# Altium schematic sheet Interface2.SchDoc
size A4; SheetNumber: 9; SheetTotal: 9
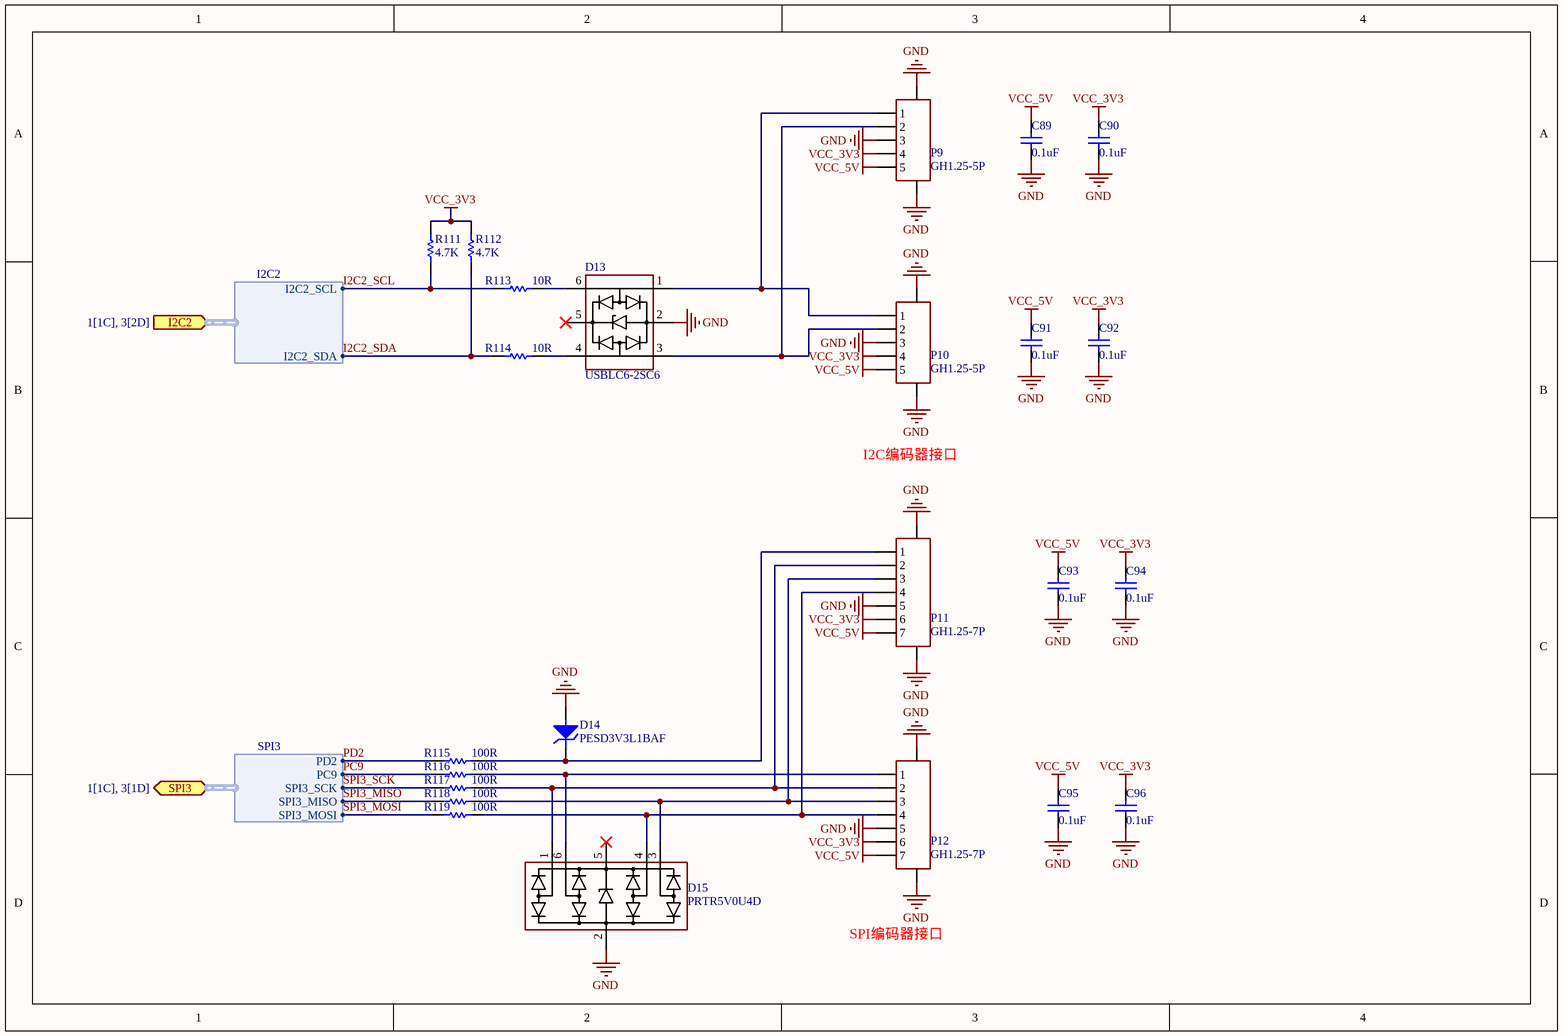
[diagram p0: Interface2.SchDoc]

## Parts
C89  0.1uF  [C0603_NS]
C90  0.1uF  [C0603_NS]
C91  0.1uF  [C0603_NS]
C92  0.1uF  [C0603_NS]
C93  0.1uF  [C0603_NS]
C94  0.1uF  [C0603_NS]
C95  0.1uF  [C0603_NS]
C96  0.1uF  [C0603_NS]
D13  USBLC6-2SC6  [SOT23-6N]
D14  PESD3V3L1BAF  [SOD-323]
D15  PRTR5V0U4D  [SOT-457(SC-74)]
P9  GH1.25-5P  [A1257WR-S-5P]
P10  GH1.25-5P  [A1257WR-S-5P]
P11  GH1.25-7P  [A1257WR-S-7P]
P12  GH1.25-7P  [A1257WR-S-7P]
R111  4.7K  [R0603_NS]
R112  4.7K  [R0603_NS]
R113  10R  [R0603_NS]
R114  10R  [R0603_NS]
R115  100R  [R0603_NS]
R116  100R  [R0603_NS]
R117  100R  [R0603_NS]
R118  100R  [R0603_NS]
R119  100R  [R0603_NS]

## Ports
I2C2 (in, harness I2C2, see 1[1C], 3[2D]), SPI3 (bidir, harness SPi3, see 1[1C], 3[1D])

## Harnesses
I2C2: I2C2_SCL, I2C2_SDA
SPI3: PC9, SPI3_SCK, SPI3_MISO, SPI3_MOSI, PD2

## Nets
GND: C89.1 C90.1 C91.1 C92.1 C93.1 C94.1 C95.1 C96.1 D13.2 D14.A D15.2 P9.0 P9.3 P10.0 P10.3 P11.0 P11.5 P12.0 P12.5
VCC_3V3: C90.2 C92.2 C94.2 C96.2 P9.4 P10.4 P11.6 P12.6 R111.2 R112.2
VCC_5V: C89.2 C91.2 C93.2 C95.2 P9.5 P10.5 P11.7 P12.7
I2C2_SCL: R111.1 R113.1 ; port I2C2.I2C2_SCL
I2C2_SDA: R112.1 R114.1 ; port I2C2.I2C2_SDA
PC9: R116.1 ; port SPI3.PC9
PD2: R115.1 ; port SPI3.PD2
SPI3_MISO: R118.1 ; port SPI3.SPI3_MISO
SPI3_MOSI: R119.1 ; port SPI3.SPI3_MOSI
SPI3_SCK: R117.1 ; port SPI3.SPI3_SCK
NetD13_1: D13.1 P9.1 P10.1
NetD13_3: D13.3 P9.2 P10.2
NetD13_4: D13.4 R114.2
NetD13_6: D13.6 R113.2
NetD14_K: D14.K P11.1 R115.2
NetD15_1: D15.1 P11.2 P12.2 R117.2
NetD15_3: D15.3 P11.3 P12.3 R118.2
NetD15_4: D15.4 P11.4 P12.4 R119.2
NetD15_6: D15.6 P12.1 R116.2

Not connected (* = marked no-connect by the designer): D13 5*; D15 5*

## Notes on the sheet
- I2C编码器接口
- SPI编码器接口

## Library data of the parts
C89-C96 = Cap: Capacitor
D14 = TVS2: 单向瞬态抑制二极管; pin to pad: A>1 K>2
P9 P10 = Header5
P11 P12 = Header7
R111-R119 = Res1: Resistor